# EAGLE design linebot (EAGLE 9.6.0)
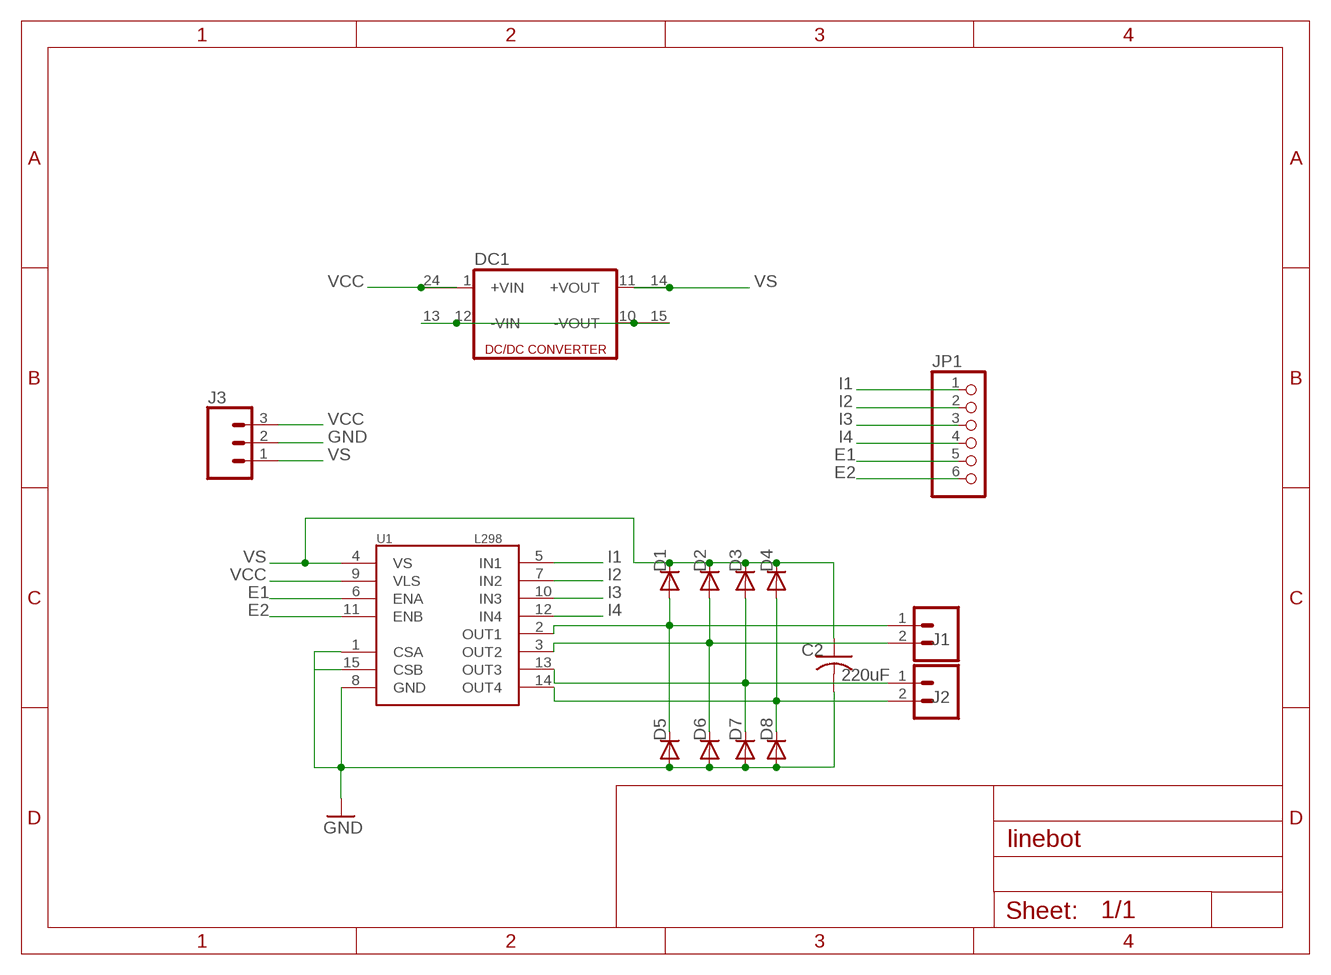
[diagram p0: schematic, sheet 1]

## Parts
C2  220uF  C-US025-024X044  [C025-024X044]
D1  1N4004  [DO41-10]
D2  1N4004  [DO41-10]
D3  1N4004  [DO41-10]
D4  1N4004  [DO41-10]
D5  1N4004  [DO41-10]
D6  1N4004  [DO41-10]
D7  1N4004  [DO41-10]
D8  1N4004  [DO41-10]
DC1  DC213R  [CMK]
J1  CONN_02  [1X02]
J2  CONN_02  [1X02]
J3  455-1750-1-ND  CONN_03  [1X03]
JP1  PINHD-1X6  [1X06]
U1  L298  [MULTIWATT15]

## Nets
E1: JP1.5 U1.6(ENA)
E2: JP1.6 U1.11(ENB)
GND: C2.2 D5.A D6.A D7.A D8.A J3.2 U1.1(CSA) U1.8(GND) U1.15(CSB)
I1: JP1.1 U1.5(IN1)
I2: JP1.2 U1.7(IN2)
I3: JP1.3 U1.10(IN3)
I4: JP1.4 U1.12(IN4)
N$1: D1.A D5.C J1.1 U1.2(OUT1)
N$2: D2.A D6.C J1.2 U1.3(OUT2)
N$3: D3.A D7.C J2.1 U1.13(OUT3)
N$4: D4.A D8.C J2.2 U1.14(OUT4)
N$5: DC1.10(-VOUT) DC1.12(-VIN) DC1.13(-VIN1) DC1.15(-VOUT1)
VCC: DC1.1(+VIN) DC1.24(+VIN1) J3.3 U1.9(VLS)
VS: C2.1 D1.C D2.C D3.C D4.C DC1.11(+VOUT) DC1.14(+VOUT1) J3.1 U1.4(VS)

## Library data of the parts
C2 = rcl:C-US: CAPACITOR, American symbol; SPICEPREFIX: C
D1-D8 = adafruit:1N4004: DIODE General purpose 1N400x type rectifier (With bigger pads) http://www.ladyada.net/library/pcb/eaglelibrary.html
DC1 = dc-dc-converter:DC213R: DC-DC CONVERTER; OC_FARNELL: unknown; OC_NEWARK: unknown
J1 J2 = SparkFun-Connectors:CONN_02: Multi connection point. Often used as Generic Header-pin footprint for 0.1 inch spaced/style header connections On any of the 0.1 inch spaced packages, you can populate with these: Break Away Headers - Straight <https://www.sparkfun.com/products/116> (PRT-00116) Break Away Male Headers - Right Angle <https://www.sparkfun.com/products/553> (PRT-00553) Female Headers <https://www.sparkfun.com/products/115> (PRT-00115) Break Away Headers - Machine Pin <https://www.sparkfun.com/products/117> (PRT-00117) Break Away Female Headers - Swiss Machine Pin <https://www.sparkfun.com/products/743> (PRT-00743) For SCREWTERMINALS and SPRING TERMINALS visit here: Screw Terimnals on SparkFun.com <https://www.sparkfun.com/search/results?term=Screw+Terminals> (5mm/3.5mm/2.54mm spacing) This device is also useful as a general connection point to wire up your design to another part of your project. Our various solder wires solder well into these plated through hole pads. Hook-Up Wire - Assortment (Stranded, 22 AWG) <https://www.sparkfun.com/products/11375> (PRT-11375) Hook-Up Wire - Assortment (Solid Core, 22 AWG) <https://www.sparkfun.com/products/11367> (PRT-11367) View the entire wire category on our website here <https://www.sparkfun.com/categories/141> Special notes: Molex polarized connector foot print use with: PRT-08233 with associated crimp pins and housings. 2.54_SCREWTERM for use with PRT-10571. 3.5mm Screw Terminal footprints for PRT-08084 5mm Screw Terminal footprints for use with PRT-08432
J3 = SparkFun-Connectors:CONN_03: Multi connection point. Often used as Generic Header-pin footprint for 0.1 inch spaced/style header connections On any of the 0.1 inch spaced packages, you can populate with these: Break Away Headers - Straight <https://www.sparkfun.com/products/116> (PRT-00116) Break Away Male Headers - Right Angle <https://www.sparkfun.com/products/553> (PRT-00553) Female Headers <https://www.sparkfun.com/products/115> (PRT-00115) Break Away Headers - Machine Pin <https://www.sparkfun.com/products/117> (PRT-00117) Break Away Female Headers - Swiss Machine Pin <https://www.sparkfun.com/products/743> (PRT-00743) Stackable Header - 3 Pin (Female, 0.1") <https://www.sparkfun.com/products/13875> (PRT-13875) For SCREWTERMINALS and SPRING TERMINALS visit here: Screw Terimnals on SparkFun.com <https://www.sparkfun.com/search/results?term=Screw+Terminals> (5mm/3.5mm/2.54mm spacing) This device is also useful as a general connection point to wire up your design to another part of your project. Our various solder wires solder well into these plated through hole pads. Hook-Up Wire - Assortment (Stranded, 22 AWG) <https://www.sparkfun.com/products/11375> (PRT-11375) Hook-Up Wire - Assortment (Solid Core, 22 AWG) <https://www.sparkfun.com/products/11367> (PRT-11367) View the entire wire category on our website here <https://www.sparkfun.com/categories/141> Special notes: Molex polarized connector foot print use with SKU : PRT-08232 with associated crimp pins and housings.; PROD_ID: XXX-00000
JP1 = pinhead:PINHD-1X6: PIN HEADER
U1 = SparkFun-IC-Special-Function:L298: L298 Dual Full Bridge Driver

## Board
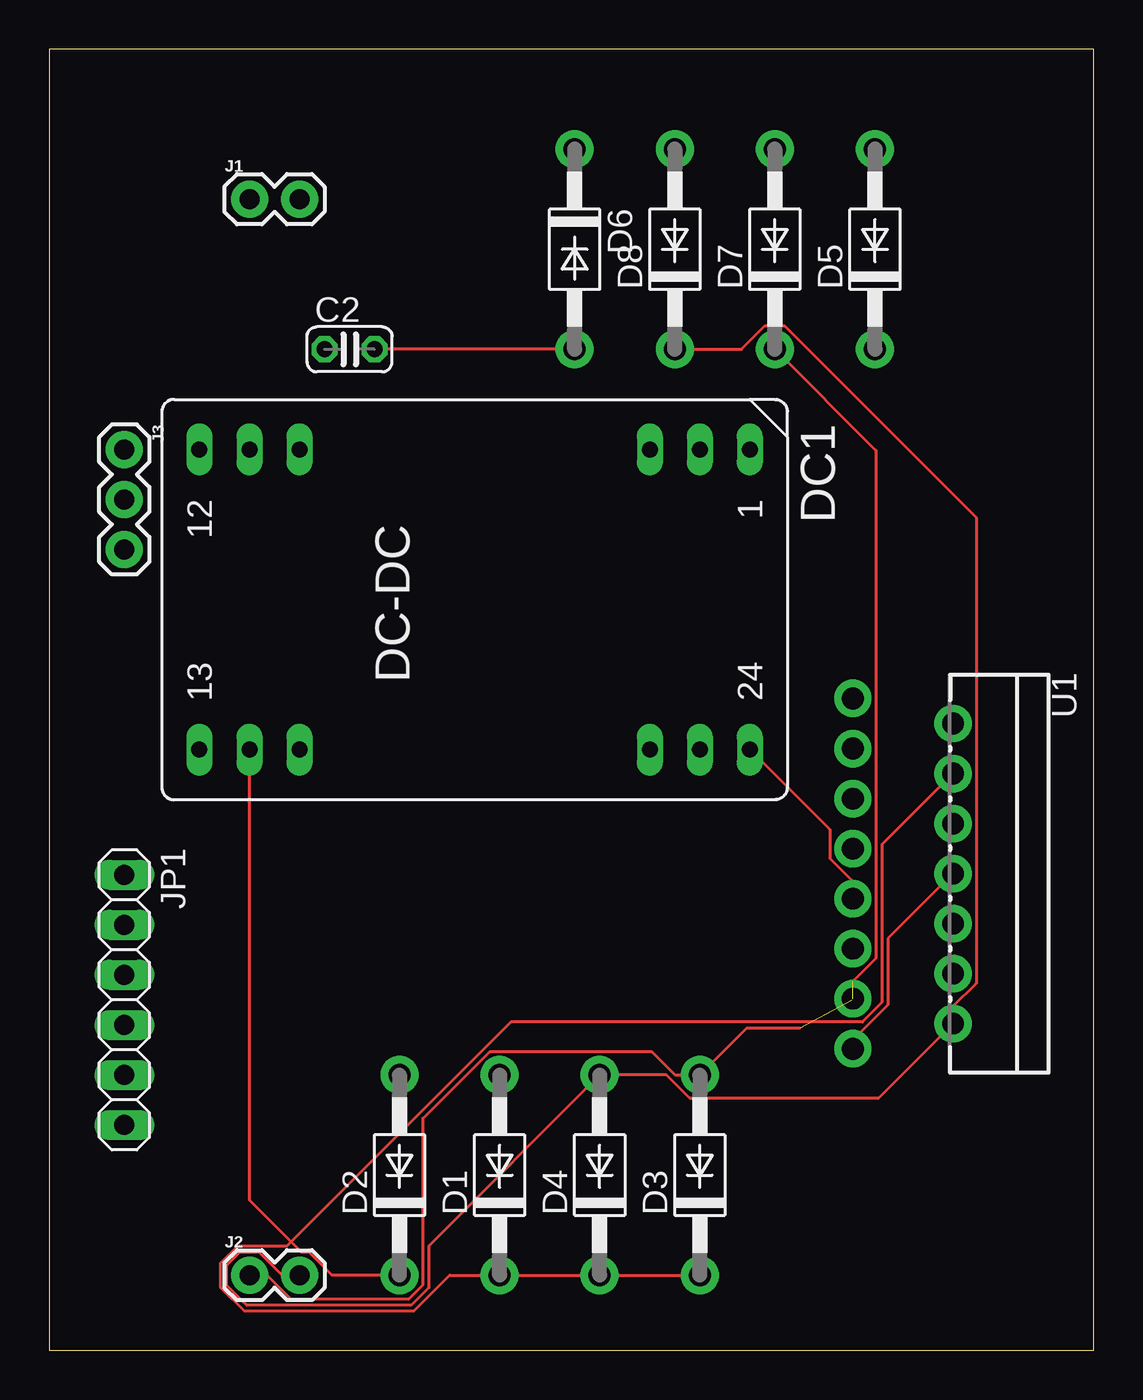
[diagram p1: board, top side]
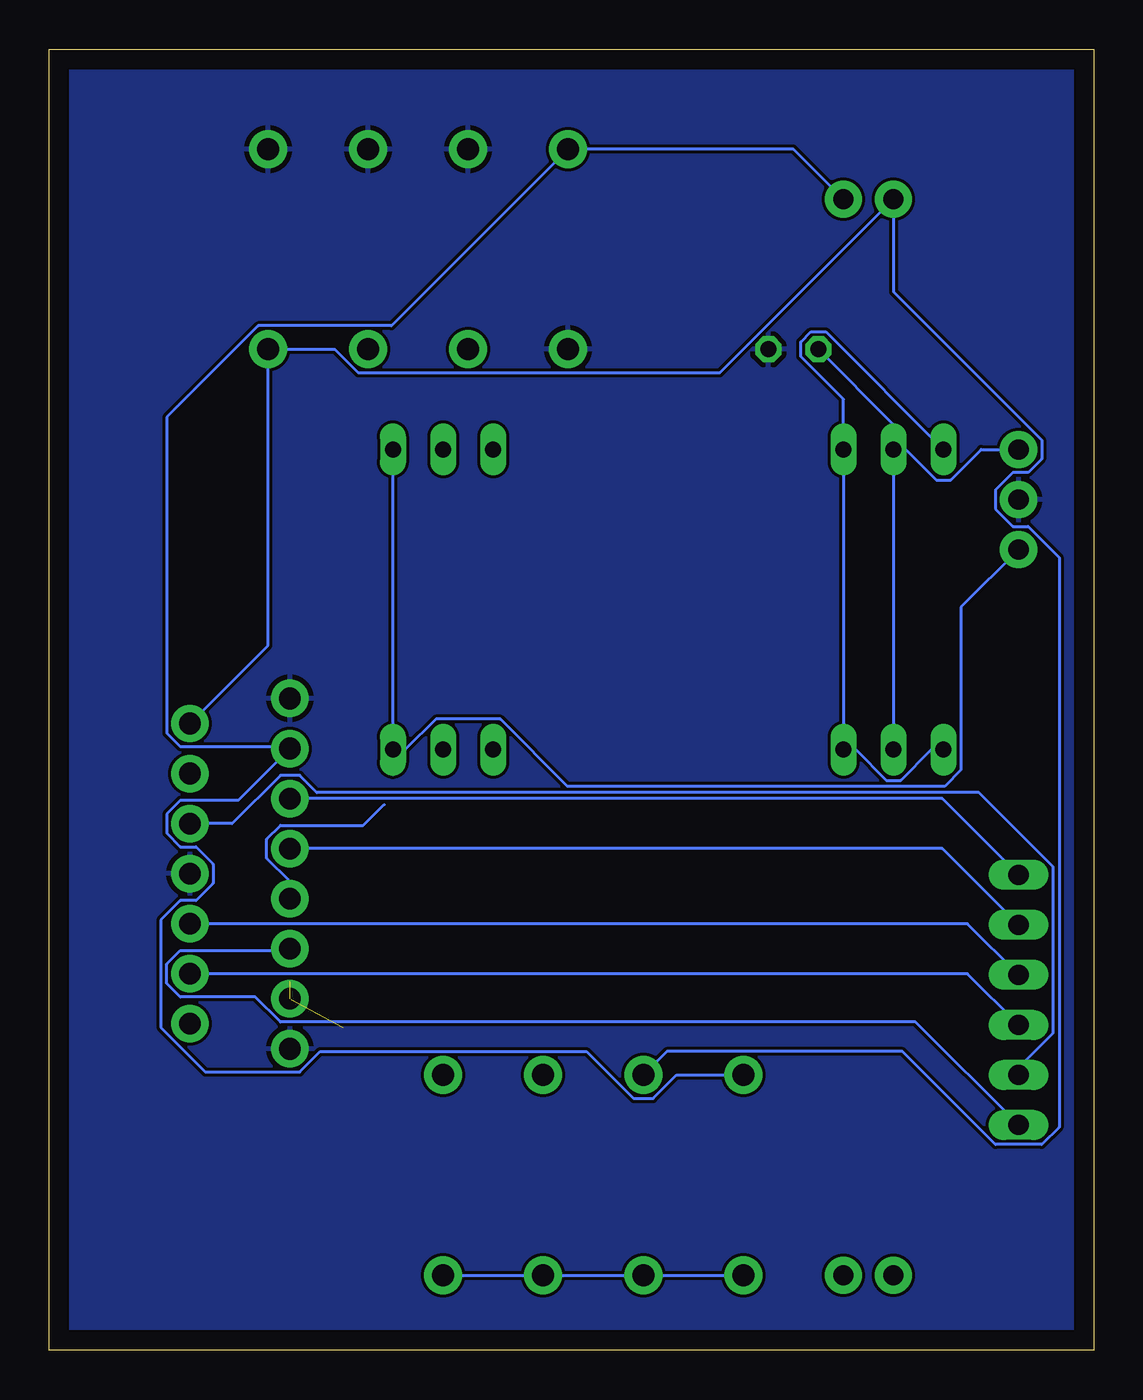
[diagram p2: board, bottom side, seen from below]

Size 53.01 x 66.03 mm. Coordinates in mm from the lower left corner, seen from the top.
Outline: 0,0 53.01,0 53.01,66.03 0,66.03 0,0
Copper layers (1*16): Top 0.035mm / dielectric 1.5mm / Bottom 0.035mm
Design rules "default": minimum track width 6mil, minimum drill 0.35mm, track to track 6mil, track to pad 6mil, pad to pad 6mil, via to via 6mil, smd to smd 6mil, copper to edge 40mil, drill to drill 6mil, minimum pad ring 10mil, minimum via ring 8mil, stop-mask expansion 4mil, vias tented up to drill 0mil, thermal gap 10mil

### Footprints (pad centres in the part's own frame; a part is rotated, then mirrored left to right if it is on the bottom)
C025-024X044 = drill 0.813 octagon: 1 -1.27,0; 2 1.27,0
DO41-10 = drill 1.118 pad 1.93: A 5.08,0; C -5.08,0
CMK = drill 0.813 long: 1 -7.62,13.97; 2 -7.62,11.43; 3 -7.62,8.89; 10 -7.62,-8.89; 11 -7.62,-11.43; 12 -7.62,-13.97; 13 7.62,-13.97; 14 7.62,-11.43; 15 7.62,-8.89; 22 7.62,8.89; 23 7.62,11.43; 24 7.62,13.97
1X02 = drill 1.016 pad 1.88: 1 0,0; 2 2.54,0
1X03 = drill 1.016 pad 1.88: 1 0,0; 2 2.54,0; 3 5.08,0
1X06 = drill 1.016 long: 1 -6.35,0; 2 -3.81,0; 3 -1.27,0; 4 1.27,0; 5 3.81,0; 6 6.35,0
MULTIWATT15 = drill 1.1 pad 1.9: 1 -8.95,-2.39; 2 -7.68,2.69; 3 -6.41,-2.39; 4 -5.14,2.69; 5 -3.87,-2.39; 6 -2.6,2.69; 7 -1.33,-2.39; 8 -0.06,2.69; 9 1.21,-2.39; 10 2.48,2.69; 11 3.75,-2.39; 12 5.02,2.69; 13 6.29,-2.39; 14 7.56,2.69; 15 8.83,-2.39

### Placement (x,y rotation side)
C2  15.24,50.8 0 top
D1  22.86,8.89 90 top
D2  17.78,8.89 90 top
D3  33.02,8.89 90 top
D4  27.94,8.89 90 top
D5  41.91,55.88 90 top
D6  26.67,55.88 270 top
D7  36.83,55.88 90 top
D8  31.75,55.88 90 top
DC1  21.59,38.1 270 top
J1  10.16,58.42 0 top
J2  10.16,3.81 0 top
J3  3.81,45.72 270 top
JP1  3.81,17.78 270 top
U1  43.18,24.13 270 top

### Tracks (layer width: path | path; a pad name or v marks a point on that pad's centre or on a via)
E1
  Bottom 0.152: JP1.5 3.81,14.35 2.06,16.1 2.06,24.54 5.82,28.3 39.43,28.3 40.3,29.18 41.28,29.18 43.73,26.73 U1.6
E2
  Bottom 0.152: JP1.6 9.04,16.66 41.28,16.66 42.55,17.93 46.36,17.93 47.05,18.62 47.05,19.6 46.36,20.29 40.88,20.29 U1.11
GND
  Top 0.152: U1.8 42.58,20.9 42.58,17.53 40.79,15.74 U1.15 | D6.A C2.2
  pour Bottom: 0,66.04 0,0 53.34,0 53.34,66.04
I1
  Bottom 0.152: JP1.1 7.68,28 U1.5
I2
  Bottom 0.152: JP1.2 7.68,25.46 U1.7
I3
  Bottom 0.152: JP1.3 6.41,21.65 U1.10
I4
  Bottom 0.152: JP1.4 6.41,19.11 U1.12
N$1
  Bottom 0.152: U1.2 41.91,35.77 D5.C 38.52,50.8 37.32,49.61 18.97,49.61 J1.1 10.16,53.72 2.64,46.2 2.64,45.24 3.33,44.55 4.09,44.55 4.98,43.66 4.98,42.7 4.09,41.81 3.33,41.81 1.75,40.23 1.75,11.32 2.64,10.44 4.98,10.44 9.71,15.16 21.67,15.16 D1.A
N$2
  Bottom 0.152: D2.A 21.17,13.97 22.37,12.78 23.35,12.78 25.74,15.16 39.26,15.16 40.3,14.12 45.09,14.12 47.35,16.39 47.35,21.83 46.36,22.83 45.56,22.83 44.69,23.7 44.69,24.68 45.56,25.55 46.36,25.55 47.05,26.24 47.05,27.22 46.36,27.91 43.42,27.91 U1.3 40.88,30.63 46.36,30.63 47.05,31.32 47.05,47.35 42.4,51.99 35.64,51.99 D6.C 15.24,60.96 J1.2
N$3  (2 unrouted)
  Top 0.152: 40.79,18.71 41.97,19.89 41.97,45.66 D7.C | J2.1 11.05,3.81 12.24,2.62 18.27,2.62 18.97,3.32 18.97,11.77 22.37,15.16 30.57,15.16 31.76,13.97 D3.A 35.41,16.36 38.1,16.36 | U1.13 40.73,17.78
N$4
  Top 0.152: D8.C 35.14,50.8 36.34,51.99 37.32,51.99 47.05,42.27 47.05,18.62 45.87,17.44 U1.14 42.08,12.78 32.53,12.78 31.33,13.97 D4.A 19.28,5.31 19.28,3.19 18.4,2.31 10.01,2.31 8.99,3.33 8.99,4.29 9.68,4.98 10.64,4.98 11.81,3.81 J2.2
N$5
  Bottom 0.152: DC1.13 8.24,30.48 9.79,28.93 10.53,28.93 12.08,30.48 DC1.15 DC1.10 12.7,48.27 14.86,50.43 14.86,51.17 14.34,51.69 13.6,51.69 7.63,45.72 DC1.12
VCC
  Top 0.152: DC1.24 39.61,26.43 39.61,24.97 40.79,23.79 U1.9
  Bottom 0.152: DC1.24 34.94,30.48 33.39,32.03 30.11,32.03 26.71,28.63 7.56,28.63 6.73,29.45 6.73,37.72 J3.3 | DC1.24 DC1.1 | 36.02,27.7 37.07,26.64 41.28,26.64 41.97,25.95 41.97,24.97 40.79,23.79 U1.9 | DC1.24 35.56,29.21
VS
  Top 0.152: DC1.14 10.16,7.62 12.8,4.98 13.18,4.98 14.35,3.81 D2.C | U1.4 42.27,25.67 42.27,17.66 41.28,16.66 23.43,16.66 12.05,5.28 9.55,5.28 8.69,4.42 8.69,3.2 9.88,2.01 18.53,2.01 20.33,3.81 D3.C
  Bottom 0.152: DC1.11 9.54,45.72 7.99,44.17 7.25,44.17 5.7,45.72 J3.1 | DC1.11 DC1.14 | C2.1 10.16,46.99 DC1.11 | D3.C D4.C D1.C D2.C